# Altium schematic sheet Part F.SchDoc
size A4; SheetNumber: 13; SheetTotal: 16
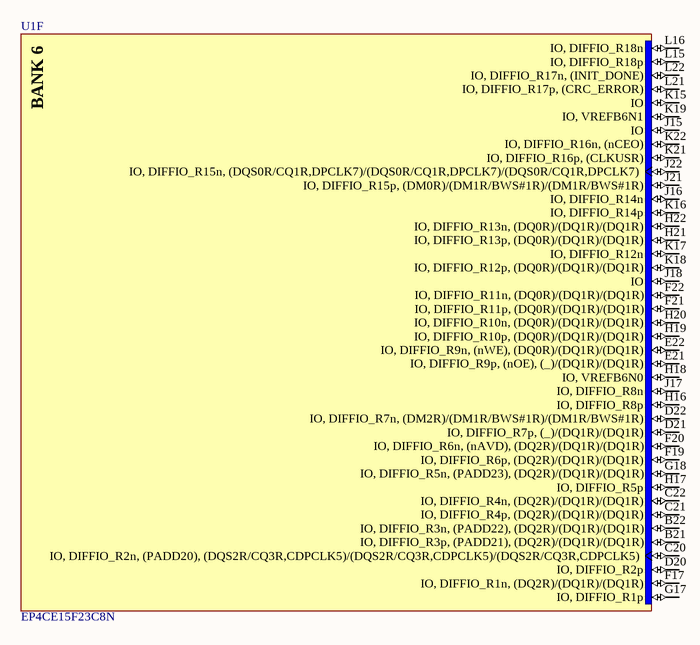
[diagram p0: Part F.SchDoc]

## Parts
U1  EP4CE15F23C8N  [FBGA484_A-240]  (part F of 13)

## Nets

Not connected (* = marked no-connect by the designer): U1 B21(IO,_DIFFIO_R3p,_(PADD21),_(DQ2R)/(DQ1R)/(DQ1R)) B22(IO,_DIFFIO_R3n,_(PADD22),_(DQ2R)/(DQ1R)/(DQ1R)) C20(IO,_DIFFIO_R2n,_(PADD20),_(DQS2R/CQ3R,CDPCLK5)/(DQS2R/CQ3R,CDPCLK5)/(DQS2R/CQ3R,CDPCLK5)) C21(IO,_DIFFIO_R4p,_(DQ2R)/(DQ1R)/(DQ1R)) C22(IO,_DIFFIO_R4n,_(DQ2R)/(DQ1R)/(DQ1R)) D20(IO,_DIFFIO_R2p) D21(IO,_DIFFIO_R7p,_(_)/(DQ1R)/(DQ1R)) D22(IO,_DIFFIO_R7n,_(DM2R)/(DM1R/BWS#1R)/(DM1R/BWS#1R)) E21(IO,_DIFFIO_R9p,_(nOE),_(_)/(DQ1R)/(DQ1R)) E22(IO,_DIFFIO_R9n,_(nWE),_(DQ0R)/(DQ1R)/(DQ1R)) F17(IO,_DIFFIO_R1n,_(DQ2R)/(DQ1R)/(DQ1R)) F19(IO,_DIFFIO_R6p,_(DQ2R)/(DQ1R)/(DQ1R)) F20(IO,_DIFFIO_R6n,_(nAVD),_(DQ2R)/(DQ1R)/(DQ1R)) F21(IO,_DIFFIO_R11p,_(DQ0R)/(DQ1R)/(DQ1R)) F22(IO,_DIFFIO_R11n,_(DQ0R)/(DQ1R)/(DQ1R)) G17(IO,_DIFFIO_R1p) G18(IO,_DIFFIO_R5n,_(PADD23),_(DQ2R)/(DQ1R)/(DQ1R)) H16(IO,_DIFFIO_R8p) H17(IO,_DIFFIO_R5p) H18(IO,_VREFB6N0) H19(IO,_DIFFIO_R10p,_(DQ0R)/(DQ1R)/(DQ1R)) H20(IO,_DIFFIO_R10n,_(DQ0R)/(DQ1R)/(DQ1R)) H21(IO,_DIFFIO_R13p,_(DQ0R)/(DQ1R)/(DQ1R)) H22(IO,_DIFFIO_R13n,_(DQ0R)/(DQ1R)/(DQ1R)) J15(IO) J16(IO,_DIFFIO_R14n) J17(IO,_DIFFIO_R8n) J18(IO) J21(IO,_DIFFIO_R15p,_(DM0R)/(DM1R/BWS#1R)/(DM1R/BWS#1R)) J22(IO,_DIFFIO_R15n,_(DQS0R/CQ1R,DPCLK7)/(DQS0R/CQ1R,DPCLK7)/(DQS0R/CQ1R,DPCLK7)) K15(IO) K16(IO,_DIFFIO_R14p) K17(IO,_DIFFIO_R12n) K18(IO,_DIFFIO_R12p,_(DQ0R)/(DQ1R)/(DQ1R)) K19(IO,_VREFB6N1) K21(IO,_DIFFIO_R16p,_(CLKUSR)) K22(IO,_DIFFIO_R16n,_(nCEO)) L15(IO,_DIFFIO_R18p) L16(IO,_DIFFIO_R18n) L21(IO,_DIFFIO_R17p,_(CRC_ERROR)) L22(IO,_DIFFIO_R17n,_(INIT_DONE))

## Notes on the sheet
- (in symbol FPGA_EP4CE15F23C8N, part F) BANK 6

## Library data of the parts
U1 = FPGA_EP4CE15F23C8N: Cyclone IV Family FPGA, 1.2V Core, 343 I/O Pins, 4 PLLs, 484-Pin FBGA, Speed Grade 8, Commercial Grade, Pb-Free; Manufacturer: Altera; PackageVersion: ver1.0, Jun-2011; PackageReference: FBGA484_A-240; ComponentLink3URL: http://www.altera.com/literature/lit-dp.jsp?category=cyc%204&showspreadsheet=y; ComponentLink1Description: Manufacturer URL; DatasheetVersion: ver1.6, Nov-2011; ComponentLink3Description: Pinout; ComponentLink2URL: http://www.altera.com/literature/hb/cyclone-iv/cyclone4-handbook.pdf; ComponentLink1URL: http://www.altera.com/; ComponentLink2Description: Handbook; PackageDescription: 484-Pin FineLine Ball Grid Array (FBGA) - Wire Bond - A:2.40; Code_JEDEC: MS-034-AAJ-1; ComponentLink4URL: http://www.altera.com/devicepackaging/04R00247-02.pdf; ComponentLink4Description: Package Specification